# Altium project FIT_PM_Dual_Range_AFE.PrjPcb (part 2 of 8)

## Sheet PM12_Supply_LED.SchDoc: FIT_PM12 board
size 420 x 297 mm; CheckedBy: G.Kasprowicz; Author: INR Moscow; CompanyName: WUT ISE; DrawnBy: M.Podgórski; Organization: WUT ISE; Address1: PW ISE; Address2: Nowowiejska 15/19 00-665 Warsaw; Address3: gkasprow@gmail.com; DocumentNumber: 14; Revision: 2; SheetNumber: 12; SheetTotal: 21; ModifiedBy: -; CheckedDate: -; Title2: PSU logics LEDs; DivGrp: WUT ISE; Designer: INR RAS; ModifiedDate: -; ProjectName: Sensor Box
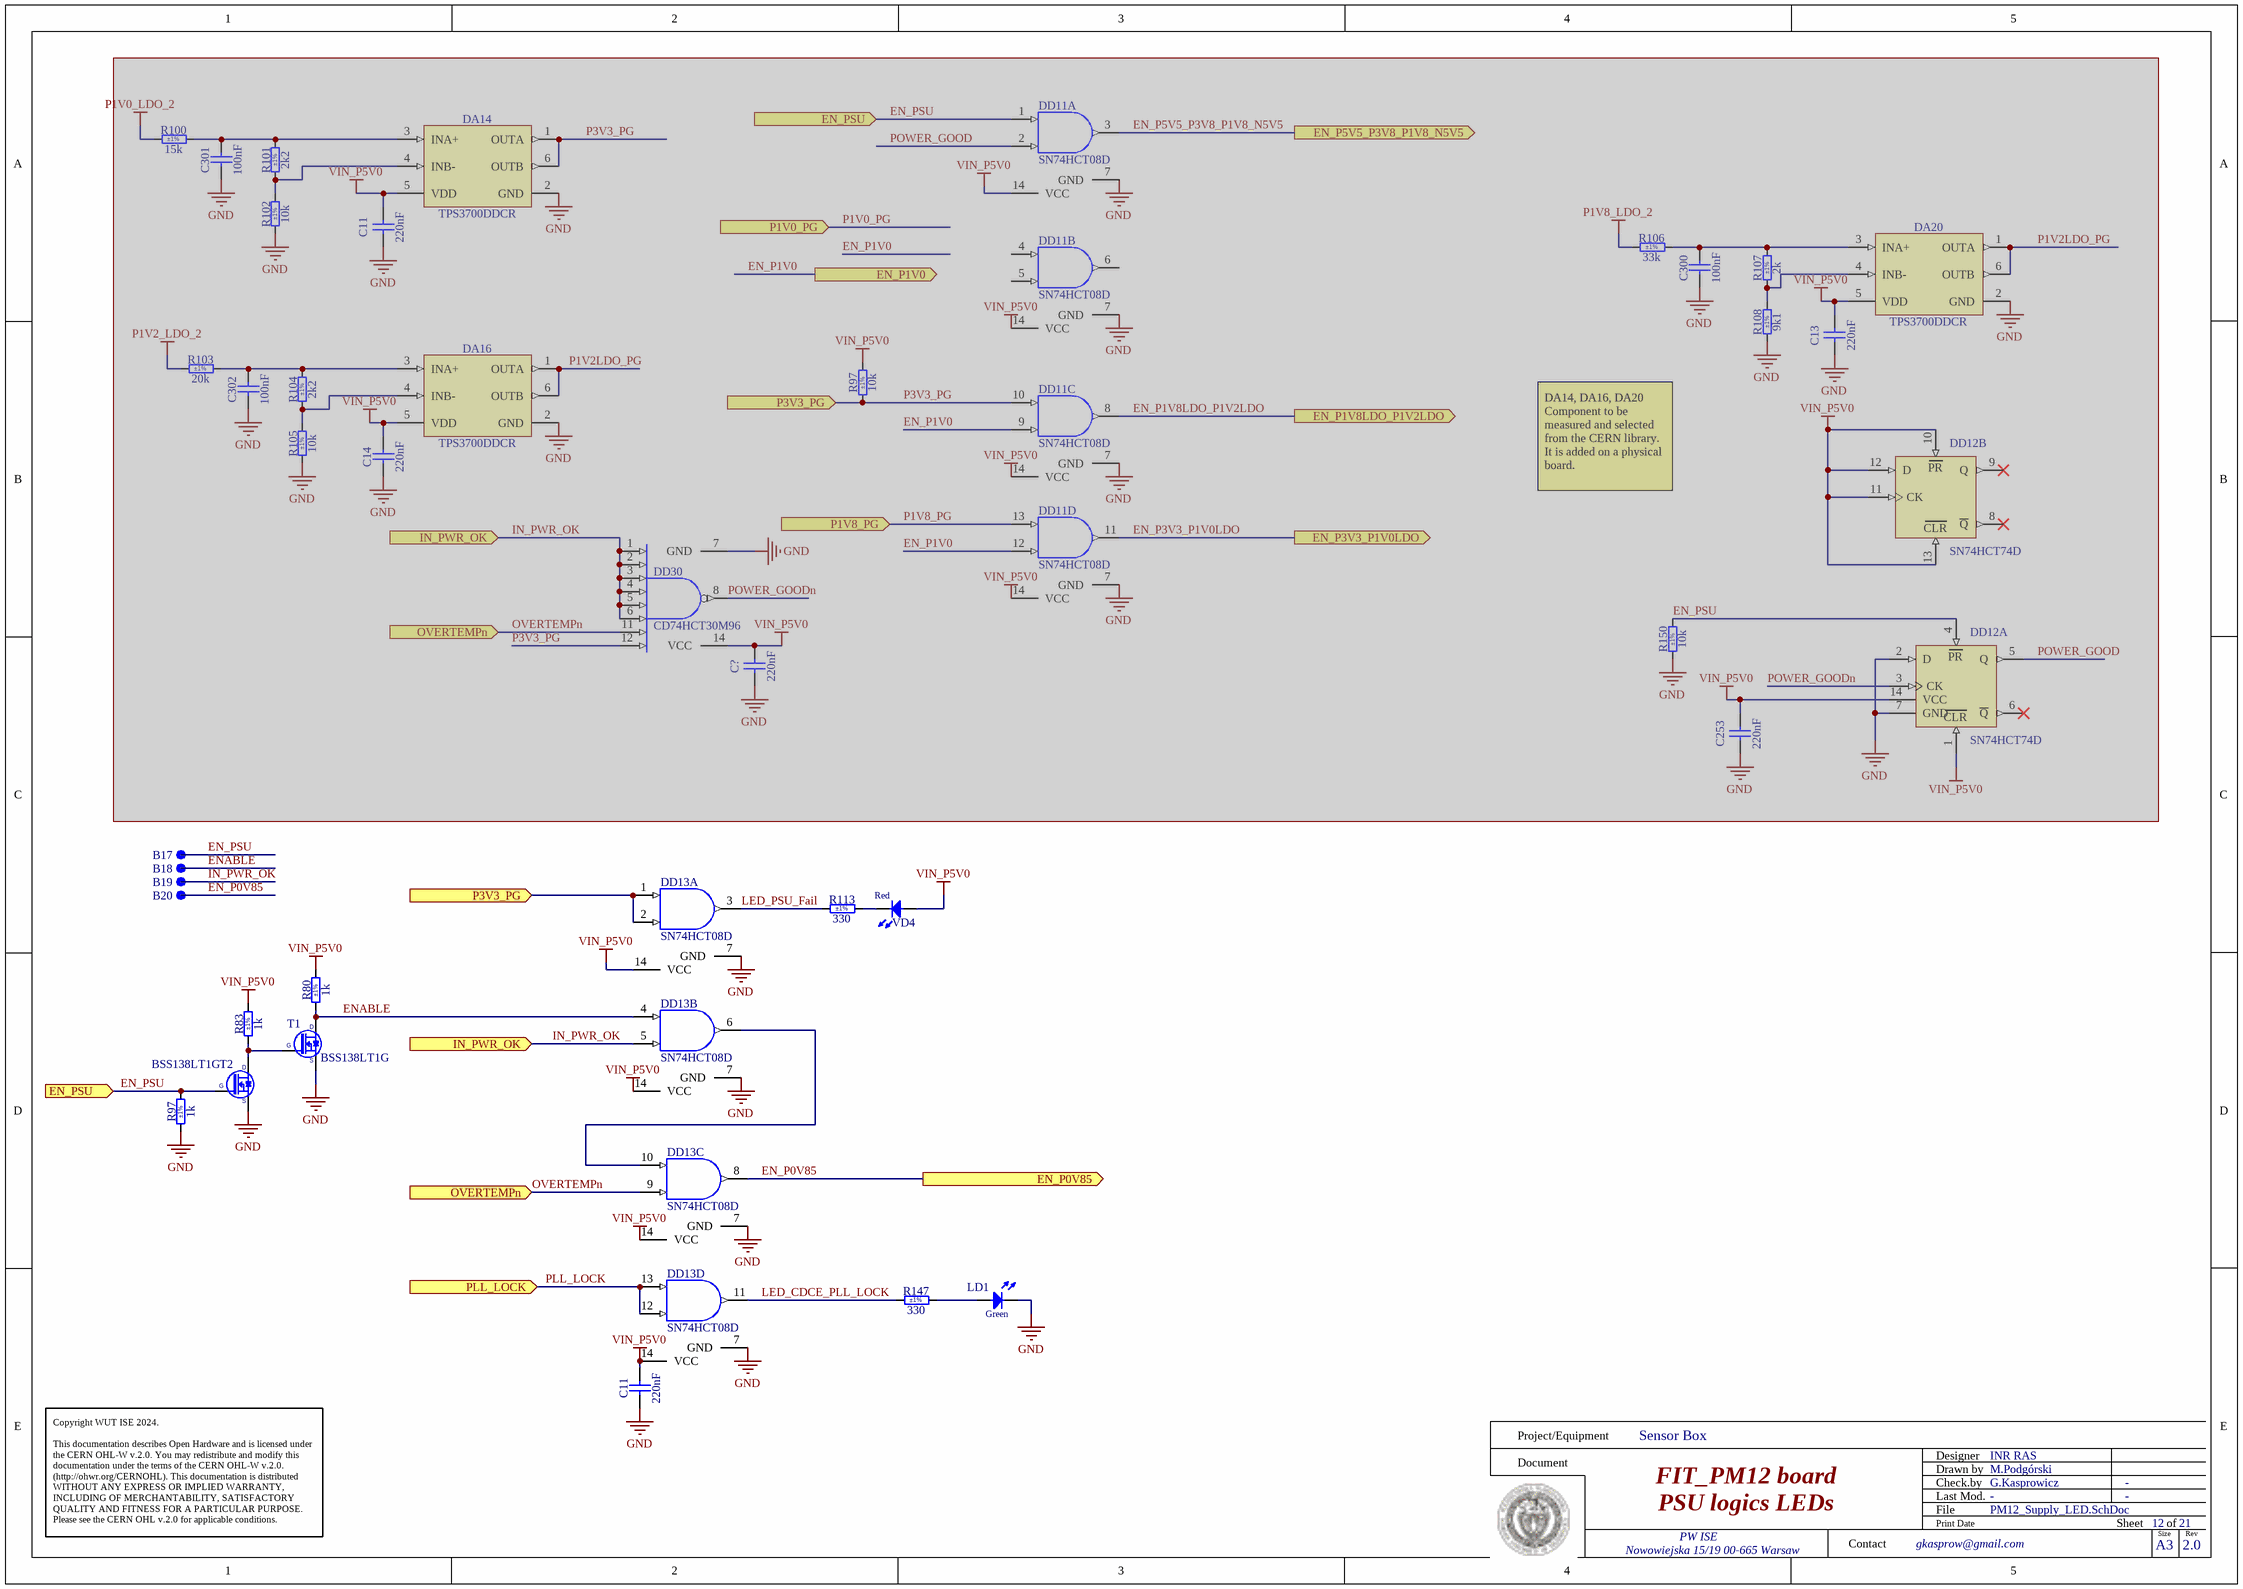
[diagram p5: PM12_Supply_LED.SchDoc]

### Parts
(Parts that share a designator on the sheet are numbered #1, #2 ... from top to bottom, then left to right.)
B17  SMD Pad  [C100]  (value not drawn)  (no BOM)
B18  SMD Pad  [C100]  (value not drawn)  (no BOM)
B19  SMD Pad  [C100]  (value not drawn)  (no BOM)
B20  SMD Pad  [C100]  (value not drawn)  (no BOM)
C11#1  220nF  [CAPC2012X135N]  (masked out: inside a compile mask, not in the netlist)
C11#2  220nF  [CAPC1005X55N]
C13#1  220nF  [CAPC2012X135N]  (masked out: inside a compile mask, not in the netlist)
C14#1  220nF  [CAPC2012X135N]  (masked out: inside a compile mask, not in the netlist)
C253  220nF  [CAPC2012X135N]  (masked out: inside a compile mask, not in the netlist)
C300  100nF  [CAPC1005X55N]  (masked out: inside a compile mask, not in the netlist)
C301  100nF  [CAPC1005X55N]  (masked out: inside a compile mask, not in the netlist)
C302  100nF  [CAPC1005X55N]  (masked out: inside a compile mask, not in the netlist)
C?  220nF  [CAPC2012X135N]  (masked out: inside a compile mask, not in the netlist)
DA14  TPS3700DDCR  [SOT95P280X110-6N]  (masked out: inside a compile mask, not in the netlist)
DA16  TPS3700DDCR  [SOT95P280X110-6N]  (masked out: inside a compile mask, not in the netlist)
DA20  TPS3700DDCR  [SOT95P280X110-6N]  (masked out: inside a compile mask, not in the netlist)
DD11  SN74HCT08D  [SOIC127P600X175-14N]  (parts A,B,C,D of 4)  (masked out: inside a compile mask, not in the netlist)
DD12  SN74HCT74D  [SOIC127P600X175-14N]  (parts A,B of 2)  (masked out: inside a compile mask, not in the netlist)
DD13  SN74HCT08D  [SOIC127P600X175-14N]  (parts A,B,C,D of 4)
DD30  CD74HCT30M96  [SOIC127P600X175-14N]  (masked out: inside a compile mask, not in the netlist)
LD1  Green  [LED_KINGBRIGHT_KPH-1608CGCK]
R80  1k  Tolerance: ±1%  [RESC1005X40N]
R83  1k  Tolerance: ±1%  [RESC1005X40N]
R97#1  10k  Tolerance: ±1%  [RESC2012X60N]  (masked out: inside a compile mask, not in the netlist)
R97#2  1k  Tolerance: ±1%  [RESC1005X40N]
R100#1  15k  Tolerance: ±1%  [RESC2012X60N]  (masked out: inside a compile mask, not in the netlist)
R101#1  2k2  Tolerance: ±1%  [RESC2012X60N]  (masked out: inside a compile mask, not in the netlist)
R102#1  10k  Tolerance: ±1%  [RESC2012X60N]  (masked out: inside a compile mask, not in the netlist)
R103#1  20k  Tolerance: ±1%  [RESC2012X60N]  (masked out: inside a compile mask, not in the netlist)
R104  2k2  Tolerance: ±1%  [RESC2012X60N]  (masked out: inside a compile mask, not in the netlist)
R105  10k  Tolerance: ±1%  [RESC2012X60N]  (masked out: inside a compile mask, not in the netlist)
R106  33k  Tolerance: ±1%  [RESC2012X60N]  (masked out: inside a compile mask, not in the netlist)
R107  2k  Tolerance: ±1%  [RESC2012X60N]  (masked out: inside a compile mask, not in the netlist)
R108  9k1  Tolerance: ±1%  [RESC2012X60N]  (masked out: inside a compile mask, not in the netlist)
R113  330  Tolerance: ±1%  [RESC1005X40N]
R147  330  Tolerance: ±1%  [RESC1005X40N]
R150  10k  Tolerance: ±1%  [RESC2012X60N]  (masked out: inside a compile mask, not in the netlist)
T1  BSS138LT1G  [SOT95P240X110-3N]
T2  BSS138LT1G  [SOT95P240X110-3N]
VD4  Red  [LED_KINGBRIGHT_KPT-2012SURCK]

### Ports
EN_P0V85 (out), EN_P1V0 (out), EN_P1V8LDO_P1V2LDO (out), EN_P3V3_P1V0LDO (out), EN_P5V5_P3V8_P1V8_N5V5 (out), EN_PSU (in), IN_PWR_OK (in), OVERTEMPn (in), P1V0_PG (in), P1V8_PG (in), P3V3_PG (in), PLL_LOCK (in)

### Nets
GND: C11#2.1 DD13.7(GND) LD1.1(C) R97#2.1 T1.2(S) T2.2(S)
VIN_P5V0: C11#2.2 DD13.14(VCC) R80.2 R83.2 VD4.2(A)  [also labelled VCC]
EN_P0V85: B20.1 DD13.8(Y) ; port EN_P0V85
EN_PSU: B17.1 R97#2.2 T2.1(G) ; port EN_PSU
ENABLE: B18.1 DD13.4(A) R80.1 T1.3(D)
IN_PWR_OK: B19.1 DD13.5(B) ; port IN_PWR_OK
LED_CDCE_PLL_LOCK: DD13.11(Y) R147.1
LED_PSU_Fail: DD13.3(Y) R113.1
OVERTEMPn: DD13.9(B) ; port OVERTEMPn
P3V3_PG: DD13.1(A) DD13.2(B) ; port P3V3_PG
PLL_LOCK: DD13.12(B) DD13.13(A) ; port PLL_LOCK
NetDD13_6: DD13.6(Y) DD13.10(A)
NetLD1_2: LD1.2(A) R147.2
NetR83_1: R83.1 T1.1(G) T2.3(D)
NetR113_2: R113.2 VD4.1(C)

### Notes on the sheet
- DA14, DA16, DA20 Component to be measured and selected from the CERN library. It is added on a physical board.
- Project/Equipment
- Document
- Designer
- Drawn by
- Check.by
- Copyright WUT ISE 2024.
  This documentation describes Open Hardware and is licensed under the CERN OHL-W v.2.0. You may redistribute and modify this documentation under the terms of the CERN OHL-W v.2.0. (http://ohwr.org/CERNOHL). This documentation is distributed WITHOUT ANY EXPRESS OR IMPLIED WARRANTY, INCLUDING OF MERCHANTABILITY, SATISFACTORY QUALITY AND FITNESS FOR A PARTICULAR PURPOSE. Please see the CERN OHL v.2.0 for applicable conditions.
- Contact
- File
- Last Mod.
- Print Date
- Sheet
- Size
- A3
- of
- Rev
- (in symbol SN74HCT74D, part A) PR; CLR
- (in symbol SN74HCT74D, part B) PR; CLR

### Library data of the parts
B17-B20 = SMD_PAD_D1MM: Pad; Part Description: 1mm Diameter SMD Pad; Mounted: No; Part Number: SMD_PAD_D1MM; Component Type: Standard (No BOM); Pin Count: 1; Family: SMD Pad; Socket: No; SMD: Yes; Sense: No; Status: None; ComponentHeight: 0mm; HelpURL: Undefined; Author: CERN DEM JLC; CreateDate: 10.10.2017; LatestRevisionDate: 10.10.2017; PackageDescription: 1mm Diameter SMD Pad
C11#1 C13#1 C14#1 C253 C? = CC0805_220NF_50V_10%_X7R: Non-polarised capacitor; Part Description: SMD Multilayer Chip Ceramic Capacitor; Manufacturer: GENERIC; Manufacturer1 Part Number: GRM21BR71H224KA01L; Voltage: 50V; TC: X7R; Tolerance: ±10%; Part Number: CC0805_220NF_50V_10%_X7R; Component Kind: Standard; Component Type: Standard; Pin Count: 2; Value: 220nF; Status: Preferred; Manufacturer Part Number: CC0805_220NF_50V_10%_X7R; Case: 0805; Mounted: Yes; Socket: No; SMD: Yes; Sense: No; Manufacturer1 Example: MURATA; Manufacturer1 ComponentHeight: 1.35mm; HelpURL: \\cern.ch\dfs\Applications\Altium\Datasheets\CC0805_X7R_MURATA.pdf; Author: CERN DEM JLC; CreateDate: 03.12.2007; LatestRevisionDate: 03.12.2007
C11#2 = CC0402_220NF_16V_10%_X7R: Non-polarised capacitor; Part Description: SMD Multilayer Chip Ceramic Capacitor; Manufacturer: GENERIC; Manufacturer1 Part Number: C1005X7R1C224K050; Voltage: 16V; TC: X7R; Tolerance: ±10%; Part Number: CC0402_220NF_16V_10%_X7R; Component Kind: Standard; Component Type: Standard; Pin Count: 2; Value: 220nF; Status: Preferred; Manufacturer Part Number: CC0402_220NF_16V_10%_X7R; Case: 0402; Mounted: Yes; Socket: No; SMD: Yes; Sense: No; Manufacturer1 Example: TDK; Manufacturer1 ComponentHeight: 0.55mm; HelpURL: \\cern.ch\dfs\Applications\Altium\Datasheets\CC0402_X7R_TDK_C.pdf; Author: CERN DEM JLC; CreateDate: 25.10.2012; LatestRevisionDate: 25.10.2012
C300-C302 = CC0402_100NF_50V_10%_X7R: Non-polarised capacitor; Part Description: SMD Multilayer Chip Ceramic Capacitor; Manufacturer: GENERIC; Manufacturer1 Part Number: GRM155R71H104KE14D; Voltage: 50V; TC: X7R; Tolerance: ±10%; Part Number: CC0402_100NF_50V_10%_X7R; Component Kind: Standard; Component Type: Standard; Pin Count: 2; Value: 100nF; Status: None; Manufacturer Part Number: CC0402_100NF_50V_10%_X7R; Case: 0402; Mounted: Yes; Socket: No; SMD: Yes; Sense: No; Manufacturer1 Example: MURATA; Manufacturer1 ComponentHeight: 0.55mm; HelpURL: \\cern.ch\dfs\Applications\Altium\Datasheets\CC0402_MURATA_GRM155R71H104KE14D.pdf; Author: CERN DEM MR; CreateDate: 30.06.2017; LatestRevisionDate: 30.06.2017
DA14 DA16 DA20 = TPS3700DDCR: Window Comparator for Over- and Undervoltage Detection; Manufacturer: TEXAS INSTRUMENTS; PressFit: No; Bonding: No; Part Number: TPS3700DDCR; Component Kind: Standard; Component Type: Standard; Device: TPS3700DDCR; PackageDescription: SOT, 0.95mm Pitch; 6 Pin, 1.60mm W X 2.90mm L X 1.10mm H body, IPC Medium Density; Part Description: Window Comparator for Over- and Undervoltage Detection; Manufacturer Part Number: TPS3700DDCR; Pin Count: 6; Case: SOT23-6; Mounted: Yes; Socket: No; SMD: Yes; Sense: No; ComponentHeight: 1.1mm; Author: CERN DEM JMW; HelpURL: \\cern.ch\dfs\Applications\Altium\Datasheets\TPS3700DDCR.pdf; CreateDate: 12.02.2014; LatestRevisionDate: 12.02.2014
DD11 DD13 = SN74HCT08D: Quad 2-Input AND Gate; Part Description: Quadruple 2-Input Positive-AND Gate; Manufacturer: TEXAS INSTRUMENTS; PressFit: No; Bonding: No; Part Number: SN74HCT08D; Component Kind: Standard; Component Type: Standard; Device: SN74HCT08D; PackageDescription: SOIC, 1.27mm Pitch; 14 Pin, 4.00mm W X 8.75mm L X 1.75mm H body, IPC Medium Density; Manufacturer Part Number: SN74HCT08D; Pin Count: 14; Case: SOIC14; Mounted: Yes; Socket: No; SMD: Yes; Sense: No; ComponentHeight: 1.75mm; Author: CERN DEM HF; HelpURL: \\cern.ch\dfs\Applications\Altium\Datasheets\SN74HCT08.pdf; CreateDate: 10.06.2024; LatestRevisionDate: 10.06.2024
DD12 = SN74HCT74D: Dual D-Type Flip Flop with Preset and Clear; Part Description: Dual Positive-Edge-Triggered D-Type Flip-Flop with Clear and Preset; Manufacturer: TEXAS INSTRUMENTS; PressFit: No; Bonding: No; Part Number: SN74HCT74D; Component Kind: Standard; Component Type: Standard; Device: SN74HCT74D; PackageDescription: SOIC 14, Pitch 1.27mm - Body 4x8.75mm, IPC Medium Density; Manufacturer Part Number: SN74HCT74D; Pin Count: 14; Case: SOIC14; Mounted: Yes; Socket: No; SMD: Yes; Sense: No; ComponentHeight: 1.75mm; Author: CERN DEM JLC; HelpURL: \\cern.ch\dfs\Applications\Altium\Datasheets\SN74HCT74D.pdf; CreateDate: 11.12.2018; LatestRevisionDate: 11.12.2018
DD30 = CD74HCT30M96: 8-Input NAND Gate; Manufacturer: TEXAS INSTRUMENTS; PressFit: No; Bonding: No; Part Number: CD74HCT30M96; Component Kind: Standard; Component Type: Standard; Device: CD74HCT30M96; PackageDescription: SOIC 14, Pitch 1.27mm - Body 4x8.75mm, IPC Medium Density; Part Description: 8-Input NAND Gate; Manufacturer Part Number: CD74HCT30M96; Pin Count: 14; Case: SOIC14; Mounted: Yes; Socket: Yes; SMD: Yes; Sense: No; ComponentHeight: 1.75mm; Author: CERN DEM HF; HelpURL: \\cern.ch\dfs\Applications\Altium\Datasheets\CD74HCT30M96.pdf; CreateDate: 31.05.2024; LatestRevisionDate: 31.05.2024
LD1 = LED_KINGBRIGHT_KPH-1608CGCK: LED Green 1C 2A; Part Description: SMD Green LED, Case 1.6mmX0.8mm(0603), 0.65mm Thickness; PressFit: No; Bonding: No; Part Number: LED_KINGBRIGHT_KPH-1608CGCK; Component Kind: Standard; Component Type: Standard; Color: Green; PackageDescription: SMT Green LED, Case 0603, Body L 1.6 x W 0.8mm H 0.65mm; Manufacturer: KINGBRIGHT; Manufacturer Part Number: KPH-1608CGCK; Pin Count: 2; Case: 0603; Mounted: Yes; Socket: No; SMD: Yes; Sense: No; ComponentHeight: 0.65mm; HelpURL: \\cern.ch\dfs\Applications\Altium\Datasheets\LED_KINGBRIGHT_KPH-1608CGCK.pdf; Author: CERN DEM JLC; CreateDate: 03.07.2017; LatestRevisionDate: 03.07.2017
R80 R83 R97#2 = R0402_1K_1%_0.0625W_100PPM: Resistor - 1%; Part Description: General Purpose Thick Film Chip Resistor; Manufacturer: GENERIC; Manufacturer1 Part Number: 232270671002L; TC: ±100ppm/°C; PressFit: No; Part Number: R0402_1K_1%_0.0625W_100PPM; Component Kind: Standard; Component Type: Standard; Pin Count: 2; Value: 1k; Status: Not Recommended; Power: 0.0625W; Manufacturer Part Number: R0402_1K_1%_0.0625W_100PPM; Case: 0402; Mounted: Yes; Sense: No; Socket: No; SMD: Yes; Manufacturer1 Example: YAGEO PHYCOMP; Manufacturer1 ComponentHeight: 0.4mm; HelpURL: \\cern.ch\dfs\Applications\Altium\Datasheets\R0402_Phycomp_RC0402.pdf; Author: CERN DEM JLC; CreateDate: 03.12.2007; LatestRevisionDate: 17.10.2012
R97#1 R102#1 R105 R150 = R0805_10K_1%_0.125W_100PPM: Resistor - 1%; Part Description: General Purpose Thick Film Chip Resistor; Manufacturer: GENERIC; Manufacturer1 Part Number: NRC10F1002TRF; Power: 0.125W; TC: ±100ppm/°C; PressFit: No; Part Number: R0805_10K_1%_0.125W_100PPM; Component Kind: Standard; Component Type: Standard; Pin Count: 2; Value: 10k; Status: Preferred; Manufacturer Part Number: R0805_10K_1%_0.125W_100PPM; Case: 0805; Mounted: Yes; Sense: No; Socket: No; SMD: Yes; Manufacturer1 Example: NIC COMPONENT; Manufacturer1 ComponentHeight: 0.6mm; HelpURL: \\cern.ch\dfs\Applications\Altium\Datasheets\R0805_NIC_NRC.pdf; Author: CERN DEM JLC; CreateDate: 03.12.2007; LatestRevisionDate: 13.03.2008
R100#1 = R0805_15K_1%_0.125W_100PPM: Resistor - 1%; Part Description: General Purpose Thick Film Chip Resistor; Manufacturer: GENERIC; Manufacturer1 Part Number: NRC10F1502TRF; Power: 0.125W; TC: ±100ppm/°C; PressFit: No; Part Number: R0805_15K_1%_0.125W_100PPM; Component Kind: Standard; Component Type: Standard; Pin Count: 2; Value: 15k; Status: Preferred; Manufacturer Part Number: R0805_15K_1%_0.125W_100PPM; Case: 0805; Mounted: Yes; Sense: No; Socket: No; SMD: Yes; Manufacturer1 Example: NIC COMPONENT; Manufacturer1 ComponentHeight: 0.6mm; HelpURL: \\cern.ch\dfs\Applications\Altium\Datasheets\R0805_NIC_NRC.pdf; Author: CERN DEM JLC; CreateDate: 13.05.2013; LatestRevisionDate: 13.05.2013
R101#1 R104 = R0805_2K2_1%_0.125W_100PPM: Resistor - 1%; Part Description: General Purpose Thick Film Chip Resistor; Manufacturer: GENERIC; Manufacturer1 Part Number: NRC10F2201TRF; Power: 0.125W; TC: ±100ppm/°C; PressFit: No; Part Number: R0805_2K2_1%_0.125W_100PPM; Component Kind: Standard; Component Type: Standard; Pin Count: 2; Value: 2k2; Status: Preferred; Manufacturer Part Number: R0805_2K2_1%_0.125W_100PPM; Case: 0805; Mounted: Yes; Sense: No; Socket: No; SMD: Yes; Manufacturer1 Example: NIC COMPONENT; Manufacturer1 ComponentHeight: 0.6mm; HelpURL: \\cern.ch\dfs\Applications\Altium\Datasheets\R0805_NIC_NRC.pdf; Author: CERN DEM JLC; CreateDate: 03.12.2007; LatestRevisionDate: 13.03.2008
R103#1 = R0805_20K_1%_0.125W_100PPM: Resistor - 1%; Part Description: General Purpose Thick Film Chip Resistor; Manufacturer: GENERIC; Manufacturer1 Part Number: NRC10F2002TRF; Power: 0.125W; TC: ±100ppm/°C; PressFit: No; Part Number: R0805_20K_1%_0.125W_100PPM; Component Kind: Standard; Component Type: Standard; Pin Count: 2; Value: 20k; Status: Preferred; Manufacturer Part Number: R0805_20K_1%_0.125W_100PPM; Case: 0805; Mounted: Yes; Sense: No; Socket: No; SMD: Yes; Manufacturer1 Example: NIC COMPONENT; Manufacturer1 ComponentHeight: 0.6mm; HelpURL: \\cern.ch\dfs\Applications\Altium\Datasheets\R0805_NIC_NRC.pdf; Author: CERN DEM JLC; CreateDate: 03.12.2007; LatestRevisionDate: 13.03.2008
R106 = R0805_33K_1%_0.125W_100PPM: Resistor - 1%; Part Description: General Purpose Thick Film Chip Resistor; Manufacturer: GENERIC; Manufacturer1 Part Number: NRC10F3302TRF; Power: 0.125W; TC: ±100ppm/°C; PressFit: No; Part Number: R0805_33K_1%_0.125W_100PPM; Component Kind: Standard; Component Type: Standard; Pin Count: 2; Value: 33k; Status: Preferred; Manufacturer Part Number: R0805_33K_1%_0.125W_100PPM; Case: 0805; Mounted: Yes; Sense: No; Socket: No; SMD: Yes; Manufacturer1 Example: NIC COMPONENT; Manufacturer1 ComponentHeight: 0.6mm; HelpURL: \\cern.ch\dfs\Applications\Altium\Datasheets\R0805_NIC_NRC.pdf; Author: CERN DEM JLC; CreateDate: 03.12.2007; LatestRevisionDate: 13.03.2008
R107 = R0805_2K_1%_0.125W_100PPM: Resistor - 1%; Part Description: General Purpose Thick Film Chip Resistor; Manufacturer: GENERIC; Manufacturer1 Part Number: NRC10F2001TRF; Power: 0.125W; TC: ±100ppm/°C; PressFit: No; Part Number: R0805_2K_1%_0.125W_100PPM; Component Kind: Standard; Component Type: Standard; Pin Count: 2; Value: 2k; Status: Preferred; Manufacturer Part Number: R0805_2K_1%_0.125W_100PPM; Case: 0805; Mounted: Yes; Sense: No; Socket: No; SMD: Yes; Manufacturer1 Example: NIC COMPONENT; Manufacturer1 ComponentHeight: 0.6mm; HelpURL: \\cern.ch\dfs\Applications\Altium\Datasheets\R0805_NIC_NRC.pdf; Author: CERN DEM JLC; CreateDate: 03.12.2007; LatestRevisionDate: 13.03.2008
R108 = R0805_9K1_1%_0.125W_100PPM: Resistor - 1%; Part Description: General Purpose Thick Film Chip Resistor; Manufacturer: GENERIC; Manufacturer1 Part Number: NRC10F9101TRF; Power: 0.125W; TC: ±100ppm/°C; PressFit: No; Part Number: R0805_9K1_1%_0.125W_100PPM; Component Kind: Standard; Component Type: Standard; Pin Count: 2; Value: 9k1; Status: Preferred; Manufacturer Part Number: R0805_9K1_1%_0.125W_100PPM; Case: 0805; Mounted: Yes; Sense: No; Socket: No; SMD: Yes; Manufacturer1 Example: NIC COMPONENT; Manufacturer1 ComponentHeight: 0.6mm; HelpURL: \\cern.ch\dfs\Applications\Altium\Datasheets\R0805_NIC_NRC.pdf; Author: CERN DEM JLC; CreateDate: 03.12.2007; LatestRevisionDate: 13.03.2008
R113 R147 = R0402_330R_1%_0.0625W_100PPM: Resistor - 1%; Part Description: General Purpose Thick Film Chip Resistor; Manufacturer: GENERIC; Manufacturer1 Part Number: 232270673301L; TC: ±100ppm/°C; PressFit: No; Part Number: R0402_330R_1%_0.0625W_100PPM; Component Kind: Standard; Component Type: Standard; Pin Count: 2; Value: 330; Status: Not Recommended; Power: 0.0625W; Manufacturer Part Number: R0402_330R_1%_0.0625W_100PPM; Case: 0402; Mounted: Yes; Sense: No; Socket: No; SMD: Yes; Manufacturer1 Example: YAGEO PHYCOMP; Manufacturer1 ComponentHeight: 0.4mm; HelpURL: \\cern.ch\dfs\Applications\Altium\Datasheets\R0402_Phycomp_RC0402.pdf; Author: CERN DEM JLC; CreateDate: 03.12.2007; LatestRevisionDate: 17.10.2012
T1 T2 = BSS138LT1G: N-CHANNEL MOSFET WITH DIODE; Part Description: 50V, 200mA N-Channel Enhancement Mode Field-Effect Transistor; Manufacturer: ON SEMICONDUCTOR; PressFit: No; Bonding: No; Part Number: BSS138LT1G; Component Kind: Standard; Component Type: Standard; Device: BSS138LT1G; PackageDescription: SOT23, 0.95mm Pitch; 3 Pin, 1.40mm W X 3.00mm L X 1.10mm H body, IPC Medium Density; Manufacturer Part Number: BSS138L; Pin Count: 3; Case: SOT23-3; Mounted: Yes; Socket: No; SMD: Yes; Sense: No; ComponentHeight: 1.11mm; HelpURL: \\cern.ch\dfs\Applications\Altium\Datasheets\BSS138LT1G.pdf; Author: CERN DEM JLC; CreateDate: 23.03.2009; LatestRevisionDate: 25.05.2022
VD4 = LED_KINGBRIGHT_KPT-2012SURCK: LED Red 1C 2A; Part Description: 2.0X1.25mm, SMD Hyper Red Chip LED Lamp, KPT-2012 Series; PressFit: No; Bonding: No; Part Number: LED_KINGBRIGHT_KPT-2012SURCK; Component Kind: Standard; Component Type: Standard; Color: Red; PackageDescription: SMT Hyper Red LED, Case 2012, Body L 2.00mm X  W 1.25mm X H 0.75mm; Manufacturer: KINGBRIGHT; Manufacturer Part Number: KPT-2012SURCK; Pin Count: 2; Case: 0805; Mounted: Yes; Socket: No; SMD: Yes; Sense: No; ComponentHeight: 0.75mm; HelpURL: \\cern.ch\dfs\Applications\Altium\Datasheets\LED_KINGBRIGHT_KPT-2012SURCK.pdf; Author: CERN DEM BC; CreateDate: 06.11.2020; LatestRevisionDate: 06.11.2020

## Sheet PM12_P3V8.SchDoc: FIT_PM12 board
size 420 x 297 mm; CheckedBy: G.Kasprowicz; Author: INR Moscow; CompanyName: WUT ISE; DrawnBy: M.Podgórski; Organization: WUT ISE; Address1: PW ISE; Address2: Nowowiejska 15/19 00-665 Warsaw; Address3: gkasprow@gmail.com; DocumentNumber: 15; Revision: 2; SheetNumber: 13; SheetTotal: 21; ModifiedBy: -; CheckedDate: -; Title2: P3V8 PSU; DivGrp: WUT ISE; Designer: INR RAS; ModifiedDate: -; ProjectName: Sensor Box
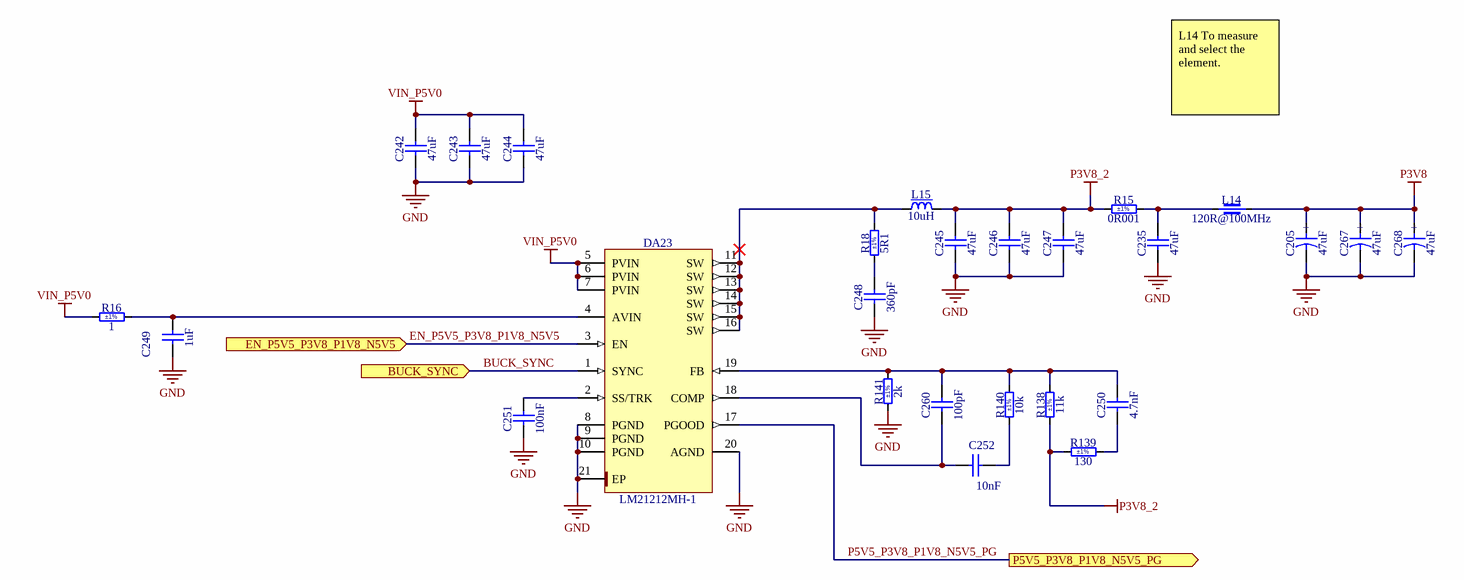
[diagram p6: PM12_P3V8.SchDoc]

### Parts
C205  47uF  [CAPAE530X610N]
C235  47uF  [CAPC3225X270N]
C242  47uF  [CAPC3225X270N]
C243  47uF  [CAPC3225X270N]
C244  47uF  [CAPC3225X270N]
C245  47uF  [CAPC3225X270N]
C246  47uF  [CAPC3225X270N]
C247  47uF  [CAPC3225X270N]
C248  360pF  [CAPC2013X145N]
C249  1uF  [CAPC2012X140N]
C250  4.7nF  [CAPC2012X135N]
C251  100nF  [CAPC2012X135N]
C252  10nF  [CAPC1005X55N]
C260  100pF  [CAPC2012X135N]
C267  47uF  [CAPAE530X610N]
C268  47uF  [CAPAE530X610N]
DA23  LM21212MH-1  [TEXAS_PWP0020AA]
L14  120R@100MHz  [IND_MURATA_BLM31KN]
L15  10uH  [IND_VISHAY_IHPL4040DZ-01]
R15  0R001  Tolerance: ±1%  [RESC_BOURNS_CRE2512_0R001-0R004]
R16  1  Tolerance: ±1%  [RESC2012X60N]
R18  5R1  Tolerance: ±1%  [RESC2012X60N]
R138  11k  Tolerance: ±1%  [RESC2012X60N]
R139  130  Tolerance: ±1%  [RESC2012X60N]
R140  10k  Tolerance: ±1%  [RESC1608X55N]
R141  2k  Tolerance: ±1%  [RESC2012X60N]

### Ports
BUCK_SYNC (in), EN_P5V5_P3V8_P1V8_N5V5 (in), P5V5_P3V8_P1V8_N5V5_PG (out)

### Nets
GND: C205.2 C235.1 C242.1 C243.1 C244.1 C245.1 C246.1 C247.1 C248.1 C249.1 C251.1 C267.2 C268.2 DA23.8(PGND) DA23.9(PGND) DA23.10(PGND) DA23.20(AGND) DA23.21(EP) R141.1
P3V8: C205.1 C267.1 C268.1 L14.2
P3V8_2: C245.2 C246.2 C247.2 L15.2 R15.1 R138.1 R139.2
VIN_P5V0: C242.2 C243.2 C244.2 DA23.5(PVIN) DA23.6(PVIN) DA23.7(PVIN) R16.1
BUCK_SYNC: DA23.1(SYNC) ; port BUCK_SYNC
EN_P5V5_P3V8_P1V8_N5V5: DA23.3(EN) ; port EN_P5V5_P3V8_P1V8_N5V5
P5V5_P3V8_P1V8_N5V5_PG: DA23.17(PGOOD) ; port P5V5_P3V8_P1V8_N5V5_PG  [project net EN_P3V3]
NetC235_2: C235.2 L14.1 R15.2
NetC248_2: C248.2 R18.1
NetC249_2: C249.2 DA23.4(AVIN) R16.2
NetC250_1: C250.1 R139.1
NetC250_2: C250.2 C260.2 DA23.19(FB) R138.2 R140.2 R141.2
NetC251_2: C251.2 DA23.2(SS/TRK)
NetC252_1: C252.1 R140.1
NetC252_2: C252.2 C260.1 DA23.18(COMP)
NetDA23_11: DA23.11(SW) DA23.12(SW) DA23.13(SW) DA23.14(SW) DA23.15(SW) DA23.16(SW) L15.1 R18.2

### Notes on the sheet
- L14 To measure and select the element.
- Project/Equipment
- Document
- Designer
- Drawn by
- Check.by
- Copyright WUT ISE 2024.
  This documentation describes Open Hardware and is licensed under the CERN OHL-W v.2.0. You may redistribute and modify this documentation under the terms of the CERN OHL-W v.2.0. (http://ohwr.org/CERNOHL). This documentation is distributed WITHOUT ANY EXPRESS OR IMPLIED WARRANTY, INCLUDING OF MERCHANTABILITY, SATISFACTORY QUALITY AND FITNESS FOR A PARTICULAR PURPOSE. Please see the CERN OHL v.2.0 for applicable conditions.
- Contact
- File
- Last Mod.
- Print Date
- Sheet
- Size
- A3
- of
- Rev
- (in symbol CAE530-610_47UF_16V_20%) +

### Library data of the parts
C205 C267 C268 = CAE530-610_47UF_16V_20%: Polarised capacitor; Part Description: Conductive Polymer Hybrid Aluminum Electrolytic Capacitor; Manufacturer: CHEMI-CON; Manufacturer Part Number: HHXD160ARA470ME61G; Voltage: 16V; Tolerance: ±20%; Part Number: CAE530-610_47UF_16V_20%; Component Kind: Standard; Component Type: Standard; Pin Count: 2; Value: 47uF; Status: Not Recommended; Case: C; Mounted: Yes; Socket: No; SMD: Yes; Sense: No; ComponentHeight: 6.1mm; HelpURL: \\cern.ch\dfs\Applications\Altium\Datasheets\CAE_CHIMI-CON_HXD.pdf; Author: CERN DEM HF; CreateDate: 15.04.2024; LatestRevisionDate: 15.04.2024
C235 C242-C247 = CC1210_47UF_16V_20%_X5R: Non-polarised capacitor; Part Description: SMD Multilayer Chip Ceramic Capacitor; Manufacturer: GENERIC; Manufacturer1 Part Number: EMK325BJ476MM-T; Voltage: 16V; TC: X5R; Tolerance: ±20%; Part Number: CC1210_47UF_16V_20%_X5R; Component Kind: Standard; Component Type: Standard; Pin Count: 2; Value: 47uF; Status: None; Manufacturer Part Number: CC1210_47UF_16V_20%_X5R; Case: 1210; Mounted: Yes; Socket: No; SMD: Yes; Sense: No; Manufacturer1 Example: TAIYO YUDEN; Manufacturer1 ComponentHeight: 2.7mm; HelpURL: \\cern.ch\dfs\Applications\Altium\Datasheets\CC1210_X5R_TAIYO-YUDEN_HIGH-VALUE.pdf; Author: CERN DEM MR; CreateDate: 03.02.2016; LatestRevisionDate: 03.02.2016
C248 = CC0805_360PF_50V_5%_C0G: Non-polarised capacitor; Part Description: SMD Multilayer Chip Ceramic Capacitor; Manufacturer: GENERIC; Manufacturer1 Part Number: CC0805JRNPO9BN361; Voltage: 50V; TC: NP0; Tolerance: ±5%; Part Number: CC0805_360PF_50V_5%_C0G; Component Kind: Standard; Component Type: Standard; Pin Count: 2; Value: 360pF; Status: None; Manufacturer Part Number: CC0805_360PF_50V_5%_C0G; Case: 0805; Mounted: Yes; Socket: No; SMD: Yes; Sense: No; Manufacturer1 Example: YAGEO PHYCOMP; Manufacturer1 ComponentHeight: 1.45mm; HelpURL: \\cern.ch\dfs\Applications\Altium\Datasheets\CC0805_NP0_YAGEO.pdf; Author: CERN DEM HF; CreateDate: 30.05.2024; LatestRevisionDate: 30.05.2024
C249 = CC0805_1UF_25V_10%_X7R: Non-polarised capacitor; Part Description: SMD Multilayer Chip Ceramic Capacitor; Manufacturer: GENERIC; Manufacturer1 Part Number: C0805C105K3RAC; Voltage: 25V; TC: X7R; Tolerance: ±10%; Part Number: CC0805_1UF_25V_10%_X7R; Component Kind: Standard; Component Type: Standard; Pin Count: 2; Value: 1uF; Status: Preferred; Manufacturer Part Number: CC0805_1UF_25V_10%_X7R; Case: 0805; Mounted: Yes; Socket: No; SMD: Yes; Sense: No; Manufacturer1 Example: KEMET; Manufacturer1 ComponentHeight: 1.4mm; HelpURL: \\cern.ch\dfs\Applications\Altium\Datasheets\CC0805_X7R_KEMET.pdf; Author: CERN DEM JLC; CreateDate: 23.03.2009; LatestRevisionDate: 23.03.2009
C250 = CC0805_4.7NF_50V_10%_X7R: Non-polarised capacitor; Part Description: SMD Multilayer Chip Ceramic Capacitor; Manufacturer: GENERIC; Manufacturer1 Part Number: 223858615632; Voltage: 50V; TC: X7R; Tolerance: ±10%; Part Number: CC0805_4.7NF_50V_10%_X7R; Component Kind: Standard; Component Type: Standard; Pin Count: 2; Value: 4.7nF; Status: Preferred; Manufacturer Part Number: CC0805_4.7NF_50V_10%_X7R; Case: 0805; Mounted: Yes; Socket: No; SMD: Yes; Sense: No; Manufacturer1 Example: PHYCOMP; Manufacturer1 ComponentHeight: 0.94mm; HelpURL: \\cern.ch\dfs\Applications\Altium\Datasheets\CC0805_X7R_PHYCOMP.pdf; Author: CERN DEM JLC; CreateDate: 03.12.2007; LatestRevisionDate: 03.12.2007
C251 = CC0805_100NF_50V_10%_X7R: Non-polarised capacitor; Part Description: SMD Multilayer Chip Ceramic Capacitor; Manufacturer: GENERIC; Manufacturer1 Part Number: C2012X7R1H104K085; Voltage: 50V; TC: X7R; Tolerance: ±10%; Part Number: CC0805_100NF_50V_10%_X7R; Component Kind: Standard; Component Type: Standard; Pin Count: 2; Value: 100nF; Status: None; Manufacturer Part Number: CC0805_100NF_50V_10%_X7R; Case: 0805; Mounted: Yes; Socket: No; SMD: Yes; Sense: No; Manufacturer1 Example: TDK; Manufacturer1 ComponentHeight: 1mm; HelpURL: \\cern.ch\dfs\Applications\Altium\Datasheets\CC0805_X7R_TDK_C.pdf; Author: CERN DEM JLC; CreateDate: 03.12.2007; LatestRevisionDate: 22.04.2015
C252 = CC0402_10NF_25V_10%_X7R: Non-polarised capacitor; Part Description: SMD Multilayer Chip Ceramic Capacitor; Manufacturer: GENERIC; Manufacturer1 Part Number: C1005X7R1E103K050; Voltage: 25V; TC: X7R; Tolerance: ±10%; Part Number: CC0402_10NF_25V_10%_X7R; Component Kind: Standard; Component Type: Standard; Pin Count: 2; Value: 10nF; Status: Preferred; Manufacturer Part Number: CC0402_10NF_25V_10%_X7R; Case: 0402; Mounted: Yes; Socket: No; SMD: Yes; Sense: No; Manufacturer1 Example: TDK; Manufacturer1 ComponentHeight: 0.55mm; HelpURL: \\cern.ch\dfs\Applications\Altium\Datasheets\CC0402_X7R_TDK_C.pdf; Author: CERN DEM JLC; CreateDate: 25.10.2012; LatestRevisionDate: 25.10.2012
C260 = CC0805_100PF_50V_5%_NP0: Non-polarised capacitor; Part Description: SMD Multilayer Chip Ceramic Capacitor; Manufacturer: GENERIC; Manufacturer1 Part Number: 223886115101; Voltage: 50V; TC: C0G/NP0; Tolerance: ±5%; Part Number: CC0805_100PF_50V_5%_NP0; Component Kind: Standard; Component Type: Standard; Pin Count: 2; Value: 100pF; Status: Preferred; Manufacturer Part Number: CC0805_100PF_50V_5%_NP0; Case: 0805; Mounted: Yes; Socket: No; SMD: Yes; Sense: No; Manufacturer1 Example: PHYCOMP; Manufacturer1 ComponentHeight: 1.35mm; HelpURL: \\cern.ch\dfs\Applications\Altium\Datasheets\CC0805_NP0_PHYCOMP.pdf; Author: CERN DEM JLC; CreateDate: 03.12.2007; LatestRevisionDate: 03.12.2007
DA23 = LM21212MH-1: 2.95-V To 5.5-V, 12-A, Voltage-Mode Synchronous Buck Regulator with Frequency Synchronization; Manufacturer: TEXAS INSTRUMENTS; PressFit: No; Bonding: No; Part Number: LM21212MH-1; Component Kind: Standard; Component Type: Standard; Device: LM21212MH-1; PackageDescription: TEXAS Case Style PWP0020AA, SOP, 0.65mm Pitch; 20 Pin, 4.40mm W X 6.50mm L X 1.10mm H body (w/thermal tab 3.4mm X 4.6mm  ), IPC Medium Density; Part Description: 2.95-V To 5.5-V, 12-A, Voltage-Mode Synchronous Buck Regulator with Frequency Synchronization; Manufacturer Part Number: LM21212MH-1; Pin Count: 21; Case: TSSOP20; Mounted: Yes; Socket: No; SMD: Yes; Sense: No; ComponentHeight: 1.1mm; HelpURL: \\cern.ch\dfs\Applications\Altium\Datasheets\LM21212MH-1.pdf; Author: CERN DEM HF; CreateDate: 05.06.2024; LatestRevisionDate: 05.06.2024
L14 = IND1206_MURATA_BLM31KN121SN1: Part Description: SMD Chip Ferrite Bead, BLM31KN_SN Series; Manufacturer: MURATA; Power: 6A; Resistance: 0.009R; Tolerance: ±25%; Part Number: IND1206_MURATA_BLM31KN121SN1; Component Kind: Standard; Component Type: Standard; Footprint: IND_MURATA_BLM31KN1; Pin Count: 2; Value: 120R@100MHz; Manufacturer Part Number: BLM31KN121SN1; Case: 1206; Mounted: Yes; Socket: No; SMD: Yes; Sense: No; ComponentHeight: 1.8mm; HelpURL: \\cern.ch\dfs\Applications\Altium\Datasheets\IND1206_MURATA_ BLM31KN_SN.pdf; Author: CERN DEM HF; CreateDate: 05.01.2022; LatestRevisionDate: 05.01.2022
L15 = IND4040_10UH_20%_VISHAY_IHLP-4040DZ-01: Inductor With Core; Part Description: IHLP® Commercial Inductor, Low DCR Series; Manufacturer: VISHAY DALE; Manufacturer Part Number: IHLP4040DZER100M01; Power: 6.8A; Resistance: 0.0332R; Tolerance: ±20%; Part Number: IND4040_10UH_20%_VISHAY_IHLP-4040DZ-01; Component Kind: Standard; Component Type: Standard; Pin Count: 2; Value: 10uH; Case: 4040; Mounted: Yes; Socket: No; SMD: Yes; Sense: No; ComponentHeight: 4mm; HelpURL: \\cern.ch\dfs\Applications\Altium\Datasheets\IND_VISHAY_IHLP4040DZ-01.pdf; Author: CERN DEM HF; CreateDate: 31.05.2024; LatestRevisionDate: 31.05.2024
R15 = R2512_0R001_1%_3W_50PPM_BOURNS_CRE2512: Resistor - 1%; Part Description: High Power Current Sense Chip Resistor; Manufacturer: BOURNS; Manufacturer Part Number: CRE2512-FZ-R001E-3; Power: 3W; TC: ±50ppm/°C; PressFit: No; Part Number: R2512_0R001_1%_3W_50PPM_BOURNS_CRE2512; Component Kind: Standard; Component Type: Standard; Pin Count: 2; Value: 0R001; Status: None; Case: 2512; Mounted: Yes; Sense: No; Socket: No; SMD: Yes; ComponentHeight: 0.9mm; HelpURL: \\cern.ch\dfs\Applications\Altium\Datasheets\R2512_BOURNS_CRE2512.pdf; Author: CERN DEM BC; CreateDate: 13.10.2021; LatestRevisionDate: 13.10.2021
R16 = R0805_1R_1%_0.125W_100PPM: Resistor - 1%; Part Description: Thick Film Chip Resistor; Manufacturer: GENERIC; Manufacturer1 Part Number: CRCW08051R00FKEA; Power: 0.125W; TC: ±100ppm/°C; PressFit: No; Part Number: R0805_1R_1%_0.125W_100PPM; Component Kind: Standard; Component Type: Standard; Pin Count: 2; Value: 1; Status: None; Manufacturer Part Number: R0805_1R_1%_0.125W_100PPM; Case: 0805; Mounted: Yes; Sense: No; Socket: No; SMD: Yes; Manufacturer1 Example: VISHAY; Manufacturer1 ComponentHeight: 0.6mm; HelpURL: \\cern.ch\dfs\Applications\Altium\Datasheets\R0805_VISHAY_CRCW e3.pdf; Author: CERN DEM HF; CreateDate: 07.06.2024; LatestRevisionDate: 07.06.2024
R18 = R0805_5R1_1%_0.125W_100PPM: Resistor - 1%; Part Description: Thick Film Chip Resistor; Manufacturer: GENERIC; Manufacturer1 Part Number: CRCW08055R10FKEAHP; Power: 0.125W; TC: ±100ppm/°C; PressFit: No; Part Number: R0805_5R1_1%_0.125W_100PPM; Component Kind: Standard; Component Type: Standard; Pin Count: 2; Value: 5R1; Status: None; Manufacturer Part Number: R0805_5R1_1%_0.125W_100PPM; Case: 0805; Mounted: Yes; Sense: No; Socket: No; SMD: Yes; Manufacturer1 Example: VISHAY; Manufacturer1 ComponentHeight: 0.6mm; HelpURL: \\cern.ch\dfs\Applications\Altium\Datasheets\R0805_VISHAY_CRCW-HP e3.pdf; Author: CERN DEM HF; CreateDate: 07.06.2024; LatestRevisionDate: 07.06.2024
R138 = R0805_11K_1%_0.125W_100PPM: Resistor - 1%; Part Description: General Purpose Thick Film Chip Resistor; Manufacturer: GENERIC; Manufacturer1 Part Number: NRC10F1102TRF; Power: 0.125W; TC: ±100ppm/°C; PressFit: No; Part Number: R0805_11K_1%_0.125W_100PPM; Component Kind: Standard; Component Type: Standard; Pin Count: 2; Value: 11k; Status: Preferred; Manufacturer Part Number: R0805_11K_1%_0.125W_100PPM; Case: 0805; Mounted: Yes; Sense: No; Socket: No; SMD: Yes; Manufacturer1 Example: NIC COMPONENT; Manufacturer1 ComponentHeight: 0.6mm; HelpURL: \\cern.ch\dfs\Applications\Altium\Datasheets\R0805_NIC_NRC.pdf; Author: CERN DEM JLC; CreateDate: 03.12.2007; LatestRevisionDate: 13.03.2008
R139 = R0805_130R_1%_0.125W_100PPM: Resistor - 1%; Part Description: General Purpose Thick Film Chip Resistor; Manufacturer: GENERIC; Manufacturer1 Part Number: NRC10F1300TRF; Power: 0.125W; TC: ±100ppm/°C; PressFit: No; Part Number: R0805_130R_1%_0.125W_100PPM; Component Kind: Standard; Component Type: Standard; Pin Count: 2; Value: 130; Status: Preferred; Manufacturer Part Number: R0805_130R_1%_0.125W_100PPM; Case: 0805; Mounted: Yes; Sense: No; Socket: No; SMD: Yes; Manufacturer1 Example: NIC COMPONENT; Manufacturer1 ComponentHeight: 0.6mm; HelpURL: \\cern.ch\dfs\Applications\Altium\Datasheets\R0805_NIC_NRC.pdf; Author: CERN DEM JLC; CreateDate: 03.12.2007; LatestRevisionDate: 13.03.2008
R140 = R0603_10K_1%_0.1W_100PPM: Resistor - 1%; Part Description: General Purpose Thick Film Chip Resistor; Manufacturer: GENERIC; Manufacturer1 Part Number: NRC06F1002TRF; Power: 0.1W; TC: ±100ppm/°C; PressFit: No; Part Number: R0603_10K_1%_0.1W_100PPM; Component Kind: Standard; Component Type: Standard; Pin Count: 2; Value: 10k; Status: Preferred; Manufacturer Part Number: R0603_10K_1%_0.1W_100PPM; Case: 0603; Mounted: Yes; Sense: No; Socket: No; SMD: Yes; Manufacturer1 Example: NIC COMPONENT; Manufacturer1 ComponentHeight: 0.55mm; HelpURL: \\cern.ch\dfs\Applications\Altium\Datasheets\R0603_NIC_NRC.pdf; Author: CERN DEM JLC; CreateDate: 03.12.2007; LatestRevisionDate: 13.03.2008
R141 = R0805_2K_1%_0.125W_100PPM: as R107 on sheet PM12_Supply_LED; Part Number: R0805_2K_1%_0.125W_100PPM; Component Kind: Standard; Component Type: Standard; Pin Count: 2; Value: 2k; Status: Preferred; Manufacturer Part Number: R0805_2K_1%_0.125W_100PPM; Case: 0805; Mounted: Yes; Sense: No; Socket: No; SMD: Yes; Manufacturer1 Example: NIC COMPONENT; Manufacturer1 ComponentHeight: 0.6mm; HelpURL: \\cern.ch\dfs\Applications\Altium\Datasheets\R0805_NIC_NRC.pdf; Author: CERN DEM JLC; CreateDate: 03.12.2007; LatestRevisionDate: 13.03.2008

## Sheet PM12_P3V3.SchDoc: FIT_PM12 board
size 420 x 297 mm; CheckedBy: G.Kasprowicz; Author: INR Moscow; CompanyName: WUT ISE; DrawnBy: M.Podgórski; Organization: WUT ISE; Address1: PW ISE; Address2: Nowowiejska 15/19 00-665 Warsaw; Address3: gkasprow@gmail.com; DocumentNumber: 16; Revision: 2; SheetNumber: 14; SheetTotal: 21; ModifiedBy: -; CheckedDate: -; Title2: P3V3 PSU; DivGrp: WUT ISE; Designer: INR RAS; ModifiedDate: -; ProjectName: Sensor Box
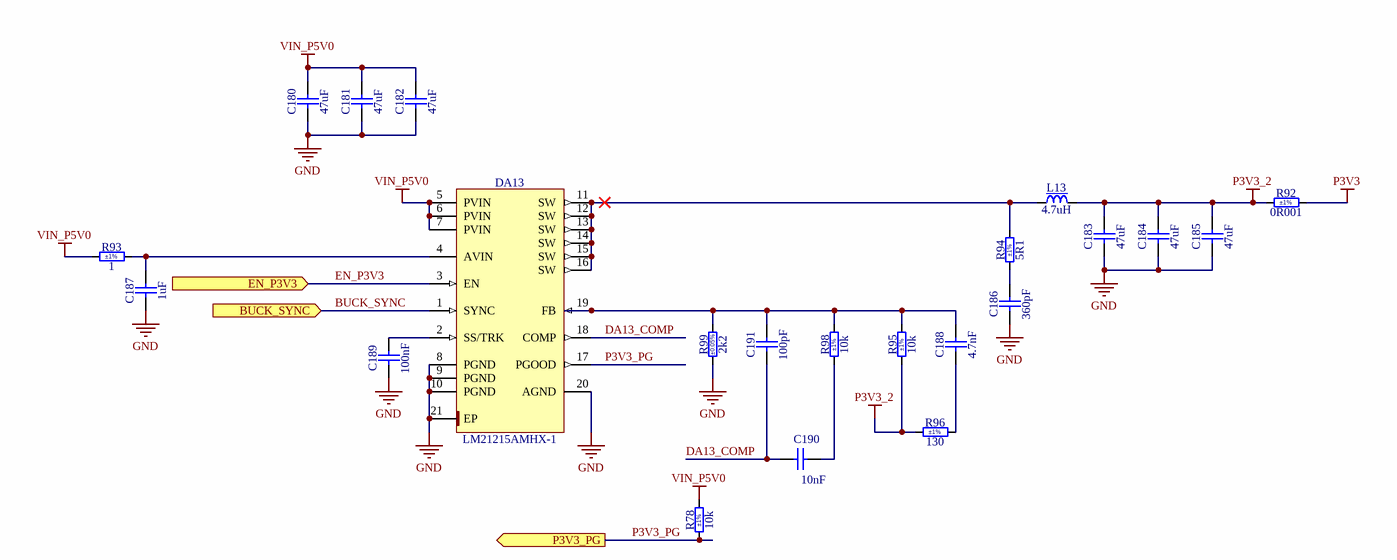
[diagram p7: PM12_P3V3.SchDoc]

### Parts
C180  47uF  [CAPC3225X270N]
C181  47uF  [CAPC3225X270N]
C182  47uF  [CAPC3225X270N]
C183  47uF  [CAPC3225X270N]
C184  47uF  [CAPC3225X270N]
C185  47uF  [CAPC3225X270N]
C186  360pF  [CAPC2013X145N]
C187  1uF  [CAPC2012X140N]
C188  4.7nF  [CAPC2012X135N]
C189  100nF  [CAPC2012X135N]
C190  10nF  [CAPC1005X55N]
C191  100pF  [CAPC2012X135N]
DA13  LM21215AMHX-1  [TEXAS_PWP0020AA]
L13  4.7uH  [INDM172170X700N]
R78  10k  Tolerance: ±1%  [RESC1608X55N]
R92  0R001  Tolerance: ±1%  [RESC_BOURNS_CRE2512_0R001-0R004]
R93  1  Tolerance: ±1%  [RESC2012X60N]
R94  5R1  Tolerance: ±1%  [RESC2012X60N]
R95  10k  Tolerance: ±1%  [RESC1608X55N]
R96  130  Tolerance: ±1%  [RESC2012X60N]
R98  10k  Tolerance: ±1%  [RESC1608X55N]
R99  2k2  Tolerance: ±0.05%  [RESC2012X60N]

### Ports
BUCK_SYNC (in), EN_P3V3 (in), P3V3_PG (out)

### Nets
GND: C180.1 C181.1 C182.1 C183.1 C184.1 C185.1 C186.1 C187.1 C189.1 DA13.8(PGND) DA13.9(PGND) DA13.10(PGND) DA13.20(AGND) DA13.21(EP) R99.1
P3V3: R92.2
P3V3_2: C183.2 C184.2 C185.2 L13.2 R92.1 R95.1 R96.1
VIN_P5V0: C180.2 C181.2 C182.2 DA13.5(PVIN) DA13.6(PVIN) DA13.7(PVIN) R78.2 R93.1
BUCK_SYNC: DA13.1(SYNC) ; port BUCK_SYNC
DA13_COMP: C190.2 C191.1 DA13.18(COMP)
EN_P3V3: DA13.3(EN) ; port EN_P3V3
P3V3_PG: DA13.17(PGOOD) R78.1 ; port P3V3_PG
NetC186_2: C186.2 R94.1
NetC187_2: C187.2 DA13.4(AVIN) R93.2
NetC188_1: C188.1 R96.2
NetC188_2: C188.2 C191.2 DA13.19(FB) R95.2 R98.2 R99.2
NetC189_2: C189.2 DA13.2(SS/TRK)
NetC190_1: C190.1 R98.1
NetDA13_11: DA13.11(SW) DA13.12(SW) DA13.13(SW) DA13.14(SW) DA13.15(SW) DA13.16(SW) L13.1 R94.2

### Notes on the sheet
- Project/Equipment
- Document
- Designer
- Drawn by
- Check.by
- Copyright WUT ISE 2024.
  This documentation describes Open Hardware and is licensed under the CERN OHL-W v.2.0. You may redistribute and modify this documentation under the terms of the CERN OHL-W v.2.0. (http://ohwr.org/CERNOHL). This documentation is distributed WITHOUT ANY EXPRESS OR IMPLIED WARRANTY, INCLUDING OF MERCHANTABILITY, SATISFACTORY QUALITY AND FITNESS FOR A PARTICULAR PURPOSE. Please see the CERN OHL v.2.0 for applicable conditions.
- Contact
- File
- Last Mod.
- Print Date
- Sheet
- Size
- A3
- of
- Rev

### Library data of the parts
C180-C185 = CC1210_47UF_16V_20%_X5R: as C235 on sheet PM12_P3V8; Part Number: CC1210_47UF_16V_20%_X5R; Component Kind: Standard; Component Type: Standard; Pin Count: 2; Value: 47uF; Status: None; Manufacturer Part Number: CC1210_47UF_16V_20%_X5R; Case: 1210; Mounted: Yes; Socket: No; SMD: Yes; Sense: No; Manufacturer1 Example: TAIYO YUDEN; Manufacturer1 ComponentHeight: 2.7mm; HelpURL: \\cern.ch\dfs\Applications\Altium\Datasheets\CC1210_X5R_TAIYO-YUDEN_HIGH-VALUE.pdf; Author: CERN DEM MR; CreateDate: 03.02.2016; LatestRevisionDate: 03.02.2016
C186 = CC0805_360PF_50V_5%_C0G: as C248 on sheet PM12_P3V8; Part Number: CC0805_360PF_50V_5%_C0G; Component Kind: Standard; Component Type: Standard; Pin Count: 2; Value: 360pF; Status: None; Manufacturer Part Number: CC0805_360PF_50V_5%_C0G; Case: 0805; Mounted: Yes; Socket: No; SMD: Yes; Sense: No; Manufacturer1 Example: YAGEO PHYCOMP; Manufacturer1 ComponentHeight: 1.45mm; HelpURL: \\cern.ch\dfs\Applications\Altium\Datasheets\CC0805_NP0_YAGEO.pdf; Author: CERN DEM HF; CreateDate: 30.05.2024; LatestRevisionDate: 30.05.2024
C187 = CC0805_1UF_25V_10%_X7R: as C249 on sheet PM12_P3V8; Part Number: CC0805_1UF_25V_10%_X7R; Component Kind: Standard; Component Type: Standard; Pin Count: 2; Value: 1uF; Status: Preferred; Manufacturer Part Number: CC0805_1UF_25V_10%_X7R; Case: 0805; Mounted: Yes; Socket: No; SMD: Yes; Sense: No; Manufacturer1 Example: KEMET; Manufacturer1 ComponentHeight: 1.4mm; HelpURL: \\cern.ch\dfs\Applications\Altium\Datasheets\CC0805_X7R_KEMET.pdf; Author: CERN DEM JLC; CreateDate: 23.03.2009; LatestRevisionDate: 23.03.2009
C188 = CC0805_4.7NF_50V_10%_X7R: as C250 on sheet PM12_P3V8; Part Number: CC0805_4.7NF_50V_10%_X7R; Component Kind: Standard; Component Type: Standard; Pin Count: 2; Value: 4.7nF; Status: Preferred; Manufacturer Part Number: CC0805_4.7NF_50V_10%_X7R; Case: 0805; Mounted: Yes; Socket: No; SMD: Yes; Sense: No; Manufacturer1 Example: PHYCOMP; Manufacturer1 ComponentHeight: 0.94mm; HelpURL: \\cern.ch\dfs\Applications\Altium\Datasheets\CC0805_X7R_PHYCOMP.pdf; Author: CERN DEM JLC; CreateDate: 03.12.2007; LatestRevisionDate: 03.12.2007
C189 = CC0805_100NF_50V_10%_X7R: as C251 on sheet PM12_P3V8; Part Number: CC0805_100NF_50V_10%_X7R; Component Kind: Standard; Component Type: Standard; Pin Count: 2; Value: 100nF; Status: None; Manufacturer Part Number: CC0805_100NF_50V_10%_X7R; Case: 0805; Mounted: Yes; Socket: No; SMD: Yes; Sense: No; Manufacturer1 Example: TDK; Manufacturer1 ComponentHeight: 1mm; HelpURL: \\cern.ch\dfs\Applications\Altium\Datasheets\CC0805_X7R_TDK_C.pdf; Author: CERN DEM JLC; CreateDate: 03.12.2007; LatestRevisionDate: 22.04.2015
C190 = CC0402_10NF_25V_10%_X7R: as C252 on sheet PM12_P3V8; Part Number: CC0402_10NF_25V_10%_X7R; Component Kind: Standard; Component Type: Standard; Pin Count: 2; Value: 10nF; Status: Preferred; Manufacturer Part Number: CC0402_10NF_25V_10%_X7R; Case: 0402; Mounted: Yes; Socket: No; SMD: Yes; Sense: No; Manufacturer1 Example: TDK; Manufacturer1 ComponentHeight: 0.55mm; HelpURL: \\cern.ch\dfs\Applications\Altium\Datasheets\CC0402_X7R_TDK_C.pdf; Author: CERN DEM JLC; CreateDate: 25.10.2012; LatestRevisionDate: 25.10.2012
C191 = CC0805_100PF_50V_5%_NP0: as C260 on sheet PM12_P3V8; Part Number: CC0805_100PF_50V_5%_NP0; Component Kind: Standard; Component Type: Standard; Pin Count: 2; Value: 100pF; Status: Preferred; Manufacturer Part Number: CC0805_100PF_50V_5%_NP0; Case: 0805; Mounted: Yes; Socket: No; SMD: Yes; Sense: No; Manufacturer1 Example: PHYCOMP; Manufacturer1 ComponentHeight: 1.35mm; HelpURL: \\cern.ch\dfs\Applications\Altium\Datasheets\CC0805_NP0_PHYCOMP.pdf; Author: CERN DEM JLC; CreateDate: 03.12.2007; LatestRevisionDate: 03.12.2007
DA13 = LM21215AMHX-1: 2.95-V To 5.5-V, 12-A, Voltage-Mode Synchronous Buck Regulator with Frequency Synchronization; Part Description: 2.95-V To 5.5-V, 15-A, Voltage-Mode Synchronous Buck Regulator with Frequency Synchronization; Manufacturer: TEXAS INSTRUMENTS; PressFit: No; Bonding: No; Part Number: LM21215AMHX-1; Component Kind: Standard; Component Type: Standard; Device: LM21215AMHX-1; PackageDescription: TEXAS Case Style PWP0020AA, SOP, 0.65mm Pitch; 20 Pin, 4.40mm W X 6.50mm L X 1.10mm H body (w/thermal tab 3.4mm X 4.6mm  ), IPC Medium Density; Manufacturer Part Number: LM21215AMHX-1; Pin Count: 21; Case: TSSOP20; Mounted: Yes; Socket: No; SMD: Yes; Sense: No; ComponentHeight: 1.1mm; HelpURL: \\cern.ch\dfs\Applications\Altium\Datasheets\LM21215AMHX-1.pdf; Author: CERN DEM HF; CreateDate: 05.06.2024; LatestRevisionDate: 05.06.2024
L13 = IND6767_4.7UH_20%_VISHAY_IHLP-6767GZ-11: Inductor With Core; Part Description: Low Profile, High Current IHLP® Inductor; Manufacturer: VISHAY DALE; Manufacturer Part Number: IHLP6767GZER4R7M11; Power: 30A; Resistance: 3.98mR; Tolerance: ±20%; Part Number: IND6767_4.7UH_20%_VISHAY_IHLP-6767GZ-11; Component Kind: Standard; Component Type: Standard; Pin Count: 2; Value: 4.7uH; Case: 6767; Mounted: Yes; Socket: No; SMD: Yes; Sense: No; ComponentHeight: 7mm; HelpURL: \\cern.ch\dfs\Applications\Altium\Datasheets\IND_VISHAY_IHLP-6767GZ-11.pdf; Author: CERN DEM HF; CreateDate: 04.06.2024; LatestRevisionDate: 04.06.2024
R78 R95 R98 = R0603_10K_1%_0.1W_100PPM: as R140 on sheet PM12_P3V8; Part Number: R0603_10K_1%_0.1W_100PPM; Component Kind: Standard; Component Type: Standard; Pin Count: 2; Value: 10k; Status: Preferred; Manufacturer Part Number: R0603_10K_1%_0.1W_100PPM; Case: 0603; Mounted: Yes; Sense: No; Socket: No; SMD: Yes; Manufacturer1 Example: NIC COMPONENT; Manufacturer1 ComponentHeight: 0.55mm; HelpURL: \\cern.ch\dfs\Applications\Altium\Datasheets\R0603_NIC_NRC.pdf; Author: CERN DEM JLC; CreateDate: 03.12.2007; LatestRevisionDate: 13.03.2008
R92 = R2512_0R001_1%_3W_50PPM_BOURNS_CRE2512: as R15 on sheet PM12_P3V8; Part Number: R2512_0R001_1%_3W_50PPM_BOURNS_CRE2512; Component Kind: Standard; Component Type: Standard; Pin Count: 2; Value: 0R001; Status: None; Case: 2512; Mounted: Yes; Sense: No; Socket: No; SMD: Yes; ComponentHeight: 0.9mm; HelpURL: \\cern.ch\dfs\Applications\Altium\Datasheets\R2512_BOURNS_CRE2512.pdf; Author: CERN DEM BC; CreateDate: 13.10.2021; LatestRevisionDate: 13.10.2021
R93 = R0805_1R_1%_0.125W_100PPM: as R16 on sheet PM12_P3V8; Part Number: R0805_1R_1%_0.125W_100PPM; Component Kind: Standard; Component Type: Standard; Pin Count: 2; Value: 1; Status: None; Manufacturer Part Number: R0805_1R_1%_0.125W_100PPM; Case: 0805; Mounted: Yes; Sense: No; Socket: No; SMD: Yes; Manufacturer1 Example: VISHAY; Manufacturer1 ComponentHeight: 0.6mm; HelpURL: \\cern.ch\dfs\Applications\Altium\Datasheets\R0805_VISHAY_CRCW e3.pdf; Author: CERN DEM HF; CreateDate: 07.06.2024; LatestRevisionDate: 07.06.2024
R94 = R0805_5R1_1%_0.125W_100PPM: as R18 on sheet PM12_P3V8; Part Number: R0805_5R1_1%_0.125W_100PPM; Component Kind: Standard; Component Type: Standard; Pin Count: 2; Value: 5R1; Status: None; Manufacturer Part Number: R0805_5R1_1%_0.125W_100PPM; Case: 0805; Mounted: Yes; Sense: No; Socket: No; SMD: Yes; Manufacturer1 Example: VISHAY; Manufacturer1 ComponentHeight: 0.6mm; HelpURL: \\cern.ch\dfs\Applications\Altium\Datasheets\R0805_VISHAY_CRCW-HP e3.pdf; Author: CERN DEM HF; CreateDate: 07.06.2024; LatestRevisionDate: 07.06.2024
R96 = R0805_130R_1%_0.125W_100PPM: as R139 on sheet PM12_P3V8; Part Number: R0805_130R_1%_0.125W_100PPM; Component Kind: Standard; Component Type: Standard; Pin Count: 2; Value: 130; Status: Preferred; Manufacturer Part Number: R0805_130R_1%_0.125W_100PPM; Case: 0805; Mounted: Yes; Sense: No; Socket: No; SMD: Yes; Manufacturer1 Example: NIC COMPONENT; Manufacturer1 ComponentHeight: 0.6mm; HelpURL: \\cern.ch\dfs\Applications\Altium\Datasheets\R0805_NIC_NRC.pdf; Author: CERN DEM JLC; CreateDate: 03.12.2007; LatestRevisionDate: 13.03.2008
R99 = R0805_2K2_1%_0.125W_100PPM: Resistor - 0.05%; Part Number: R0805_2K2_0.05%_0.125W_100PPM; Part Description: General Purpose Thick Film Chip Resistor; Manufacturer: GENERIC; Manufacturer1 Part Number: ERA-6ARW222V; Power: 0.125W; TC: ±100ppm/°C; PressFit: No; Component Kind: Standard; Component Type: Standard; Pin Count: 2; Value: 2k2; Status: Preferred; Manufacturer Part Number: R0805_2K2_0.05%_0.125W_100PPM; Case: 0805; Mounted: Yes; Sense: No; Socket: No; SMD: Yes; Manufacturer1 Example: Panasonic; Manufacturer1 ComponentHeight: 0.6mm; HelpURL: \\cern.ch\dfs\Applications\Altium\Datasheets\R0805_NIC_NRC.pdf; Author: CERN DEM JLC; CreateDate: 03.12.2007; LatestRevisionDate: 13.03.2008